# EAGLE design Module Current Probe v2 (EAGLE 7.2.0)
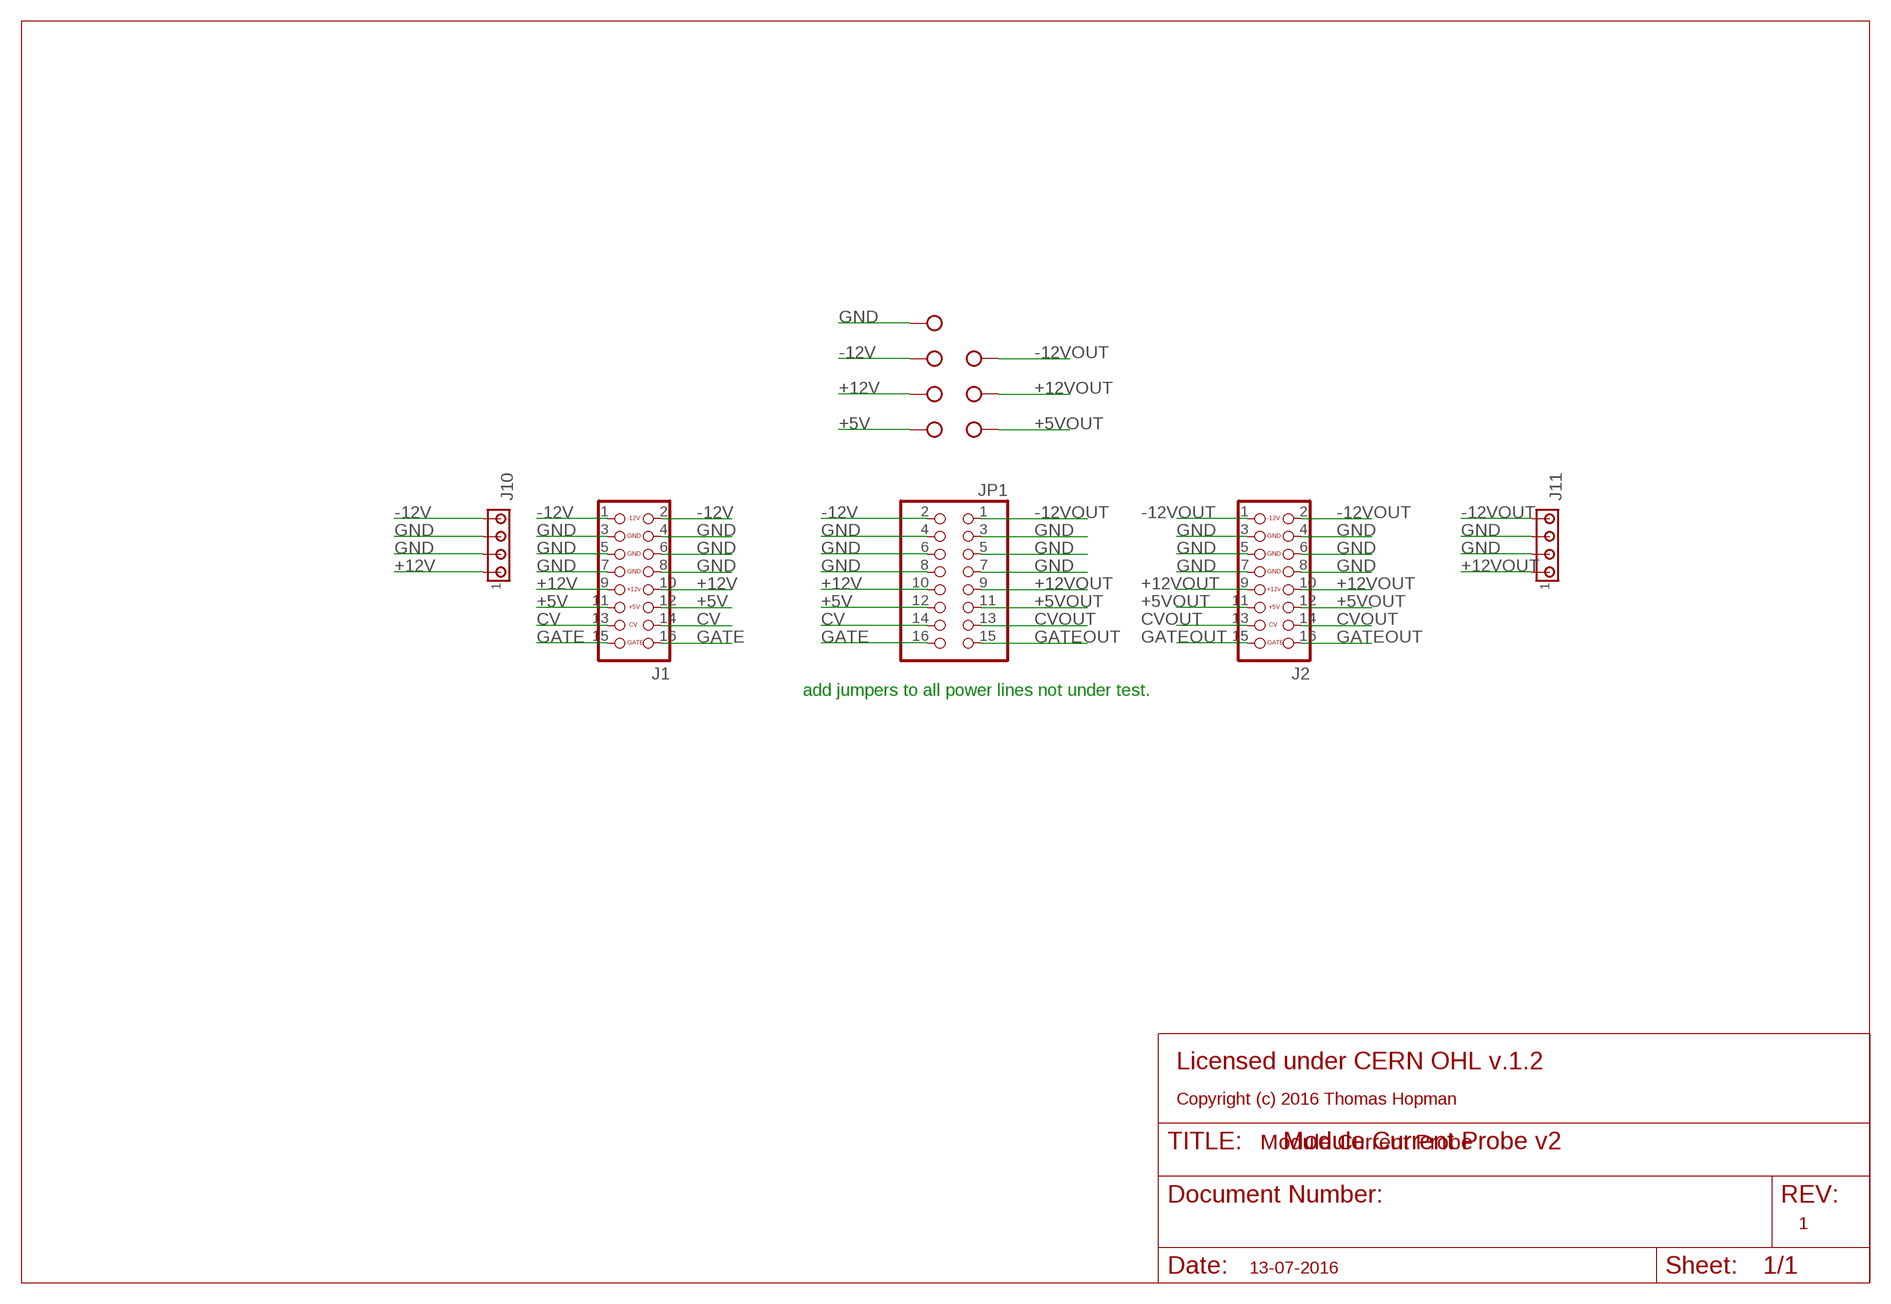
[diagram p0: schematic, sheet 1]

## Parts
J1  CON_HEADER_2X08-PTH-SHROUDED  [PINSHRD_PTH_2X08]
J2  CON_HEADER_2X08-PTH-SHROUDED  [PINSHRD_PTH_2X08]
J3  BANANA-JACK  [BANANA-PRINT]
J4  BANANA-JACK  [BANANA-PRINT]
J5  BANANA-JACK  [BANANA-PRINT]
J6  BANANA-JACK  [BANANA-PRINT]
J7  BANANA-JACK  [BANANA-PRINT]
J8  BANANA-JACK  [BANANA-PRINT]
J9  BANANA-JACK  [BANANA-PRINT]
J10  MTA04-156  [1X4MTA]
J11  MTA04-156  [1X4MTA]
JP1  PINHD-2X8  [2X08]

## Nets
+5V: J1.11 J1.12 J5.P$1(PIN) JP1.12
+5VOUT: J2.11 J2.12 J8.P$1(PIN) JP1.11
+12V: J1.9 J1.10 J4.P$1(PIN) J10.1 JP1.10
+12VOUT: J2.9 J2.10 J7.P$1(PIN) J11.1 JP1.9
-12V: J1.1 J1.2 J3.P$1(PIN) J10.4 JP1.2
-12VOUT: J2.1 J2.2 J6.P$1(PIN) J11.4 JP1.1
CV: J1.13 J1.14 JP1.14
CVOUT: J2.13 J2.14 JP1.13
GATE: J1.15 J1.16 JP1.16
GATEOUT: J2.15 J2.16 JP1.15
GND: J1.3 J1.4 J1.5 J1.6 J1.7 J1.8 J2.3 J2.4 J2.5 J2.6 J2.7 J2.8 J9.P$1(PIN) J10.2 J10.3 J11.2 J11.3 JP1.3 JP1.4 JP1.5 JP1.6 JP1.7 JP1.8

## Notes on the sheet
- add jumpers to all power lines not under test.
- Licensed under CERN OHL v.1.2
- Copyright (c) 2016 Thomas Hopman
- Module Current Probe
- 1
- 13-07-2016

## Library data of the parts
J1 J2 = tomatek:CON_HEADER_2X08
J3-J9 = con-banana:BANANA-JACK
J10 J11 = con-amp:MTA04-156: AMP connector
JP1 = pinhead:PINHD-2X8: PIN HEADER

## Board
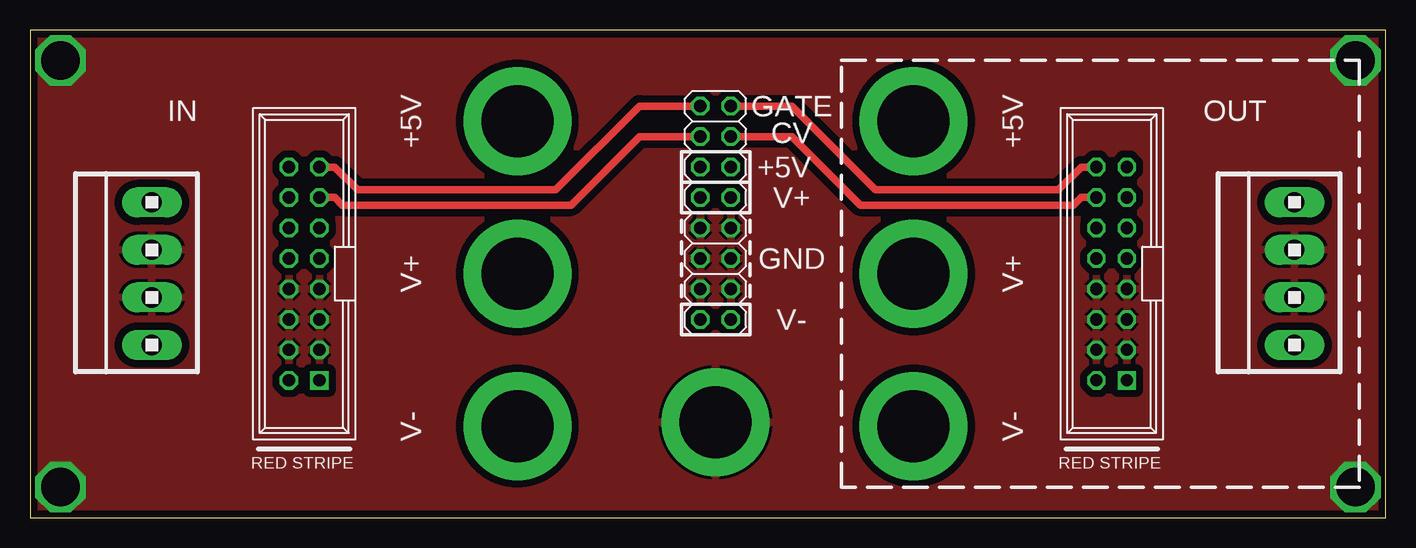
[diagram p1: board, top side]
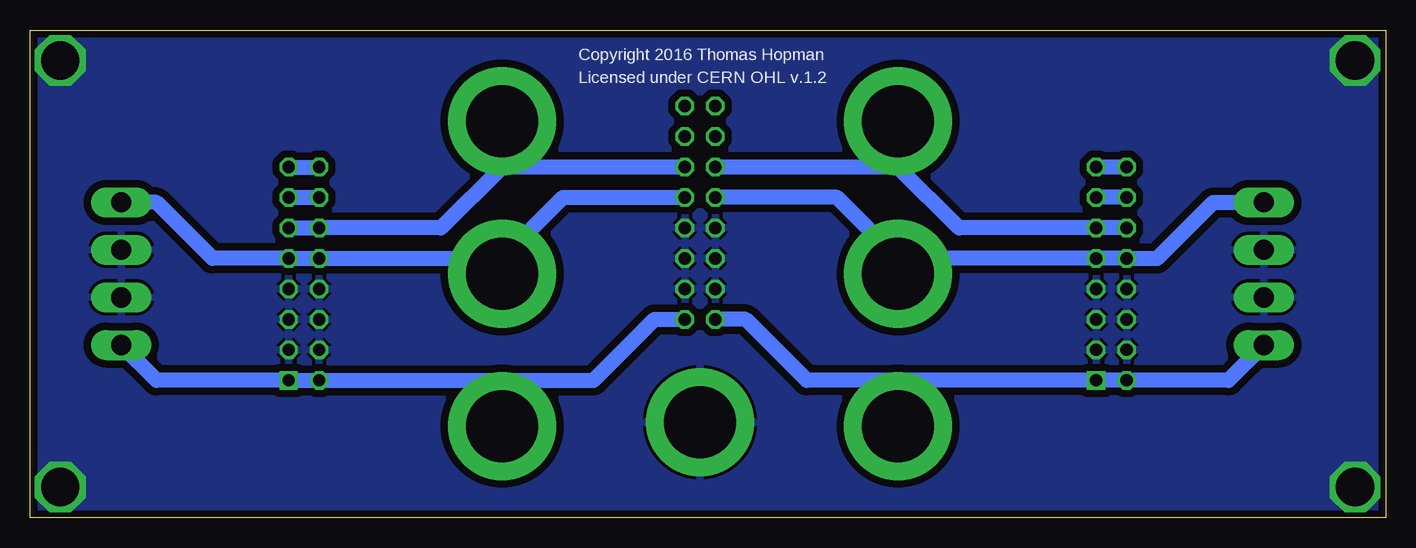
[diagram p2: board, bottom side, seen from below]

Size 113.01 x 40.63 mm. Coordinates in mm from the lower left corner, seen from the top.
Outline: 0,0 113.01,0 113.01,40.63 0,40.63 0,0
Copper layers (1*16): Top 0.035mm / dielectric 1.5mm / Bottom 0.035mm
Design rules "dirt_cheap_dirty_boards.v1": minimum track width 5mil, minimum drill 12mil, track to track 5mil, track to pad 5mil, pad to pad 5mil, via to via 5mil, smd to smd 0mil, copper to edge 10mil, drill to drill 10mil, minimum pad ring 10mil, minimum via ring 6mil, stop-mask expansion 2mil, vias tented up to drill 25mil, thermal gap 10mil

### Footprints (pad centres in the part's own frame; a part is rotated, then mirrored left to right if it is on the bottom)
PINSHRD_PTH_2X08 = drill 1.016 square: 1 -8.89,-1.27 | drill 1.016 octagon: 2 -8.89,1.27; 3 -6.35,-1.27; 4 -6.35,1.27; 5 -3.81,-1.27; 6 -3.81,1.27; 7 -1.27,-1.27; 8 -1.27,1.27; 9 1.27,-1.27; 10 1.27,1.27; 11 3.81,-1.27; 12 3.81,1.27; 13 6.35,-1.27; 14 6.35,1.27; 15 8.89,-1.27; 16 8.89,1.27
BANANA-PRINT = drill 6 pad 9: P$1 0,0
1X4MTA = drill 1.676 long: 1 5.944,0; 2 1.981,0; 3 -1.981,0; 4 -5.944,0
2X08 = drill 1.016 octagon: 1 -8.89,-1.27; 2 -8.89,1.27; 3 -6.35,-1.27; 4 -6.35,1.27; 5 -3.81,-1.27; 6 -3.81,1.27; 7 -1.27,-1.27; 8 -1.27,1.27; 9 1.27,-1.27; 10 1.27,1.27; 11 3.81,-1.27; 12 3.81,1.27; 13 6.35,-1.27; 14 6.35,1.27; 15 8.89,-1.27; 16 8.89,1.27

### Placement (x,y rotation side)
J1  22.86,20.32 90 top
J2  90.17,20.32 90 top
J3  40.64,7.62 0 top
J4  40.64,20.32 0 top
J5  40.64,33.02 0 top
J6  73.66,7.62 0 top
J7  73.66,20.32 0 top
J8  73.66,33.02 0 top
J9  57.15,7.94 0 top
J10  10.16,20.32 90 top
J11  105.41,20.32 90 top
JP1  57.15,25.4 90 top

### Tracks (layer width: path | path; a pad name or v marks a point on that pad's centre or on a via)
+5V
  Bottom 1.27: J1.12 J1.11 35.56,24.13 40.64,29.21 | J5.P$1 40.64,29.21 | 40.64,29.21 JP1.12
+5VOUT
  Bottom 1.27: J2.11 J2.12 78.74,24.13 73.66,29.21 | J8.P$1 73.66,29.21 | JP1.11 73.66,29.21
+12V
  Bottom 1.27: 40.64,21.59 J1.9 J1.10 19.05,21.59 14.38,26.26 J10.1 | 40.64,21.59 J4.P$1 | 40.64,21.59 45.72,26.67 JP1.10
+12VOUT
  Bottom 1.27: 73.66,21.59 J7.P$1 | 73.66,21.59 J2.10 J2.9 97.79,21.59 102.46,26.26 J11.1 | 73.66,21.59 68.58,26.67 JP1.9
-12V
  Bottom 1.27: 40.64,11.43 J1.1 J1.2 13.11,11.43 J10.4 | 40.64,11.43 J3.P$1 | 40.64,11.43 48.26,11.43 53.34,16.51 JP1.2
-12VOUT
  Bottom 1.27: 73.66,11.43 J2.2 J2.1 102.46,11.43 J11.4 | 73.66,11.43 J6.P$1 | 73.66,11.43 66.04,11.43 60.96,16.51 JP1.1
CV
  Top 0.61: J1.13 25.4,26.67 26.04,26.04 45.09,26.04 50.8,31.75 JP1.14
  Bottom 1.27: J1.14 J1.13
CVOUT
  Top 0.61: J2.14 87.63,26.67 87,26.04 69.22,26.04 63.5,31.75 JP1.13
  Bottom 1.27: J2.13 J2.14
GATE
  Top 0.61: J1.15 25.4,29.21 27.3,27.3 43.81,27.3 50.8,34.29 JP1.16
  Bottom 1.27: J1.16 J1.15
GATEOUT
  Top 0.61: J2.16 87.63,29.21 85.72,27.3 70.48,27.3 63.5,34.29 JP1.15
  Bottom 1.27: J2.15 J2.16
GND  (via drill 3.2)
  other vias: 2.54,38.1 2.54,2.54 110.49,38.1 110.49,2.54
  pour Bottom (isolate 0.61): 0,40.64 113.03,40.64 113.03,0 0,0
  pour Top (isolate 0.61): 0,0 113.03,0 113.03,40.64 0,40.64

### Text on the board
bPlace: Copyright 2016 Thomas Hopman | Licensed under CERN OHL v.1.2
_tsilk: GATE | IN | +5V | +5V | OUT | CV | +5V | V+ | GND | V+ | V+ | V- | V- | V-